# EAGLE design esp-12 (EAGLE 7.7.0)
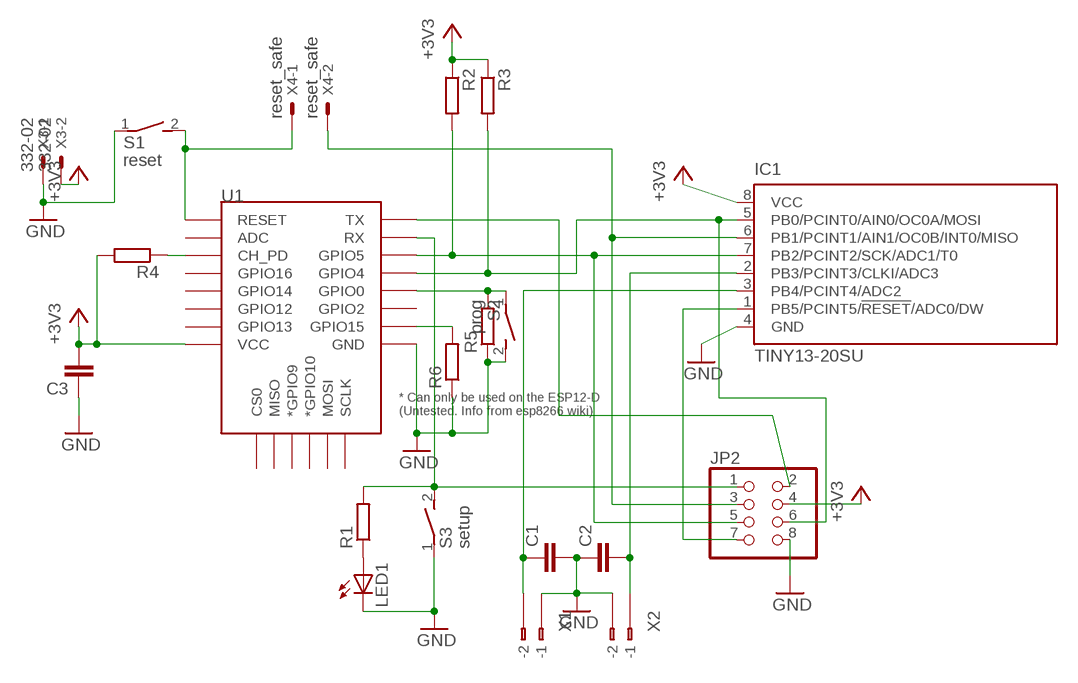
[diagram p0: schematic, sheet 1]

## Parts
C1  C-EUC0805  [C0805]
C2  C-EUC0805  [C0805]
C3  C-EUC0805  [C0805]
IC1  TINY13-20SU  [8S2]
JP2  PINHD-2X4  [2X04]
LED1  LEDSQR2X5  [LED2X5]
R1  R-EU_R0805  [R0805]
R2  R-EU_R0805  [R0805]
R3  R-EU_R0805  [R0805]
R4  R-EU_R0805  [R0805]
R5  R-EU_R0805  [R0805]
R6  R-EU_R0805  [R0805]
S1  reset  DS01E  [DS-01]
S2  prog  DS01E  [DS-01]
S3  setup  DS01E  [DS-01]
U1  ESP12ESMD  [ESP12E-SMD]
X1  233-102  [233-102]
X2  233-102  [233-102]
X3  332-02  [332-02]
X4  reset_safe  332-02  [332-02]

## Nets
+3V3: C3.2 IC1.8(VCC) JP2.4 R2.1 R3.1 R4.2 U1.VCC X3.2
GND: C1.2 C2.1 C3.1 IC1.4(GND) JP2.8 LED1.K(C) R5.1 R6.1 S1.1 S2.2 S3.1 U1.GND X1.B1(B-1) X2.B2(B-2) X3.1
N$1: IC1.7(PB2/PCINT2/SCK/ADC1/T0) JP2.5 R2.2 U1.GPIO5
N$2: IC1.5(PB0/PCINT0/AIN0/OC0A/MOSI) JP2.6 R3.2 U1.GPIO4
N$3: R5.2 S2.1 U1.GPIO0
N$4: R6.2 U1.GPIO15
N$5: IC1.1(PB5/PCINT5/!RESET!/ADC0/DW) JP2.7
N$6: C2.2 IC1.2(PB3/PCINT3/CLKI/ADC3) X2.B1(B-1)
N$7: IC1.6(PB1/PCINT1/AIN1/OC0B/INT0/MISO) JP2.3 X4.2
N$9: C1.1 IC1.3(PB4/PCINT4/ADC2) X1.B2(B-2)
N$10: S1.2 U1.RESET X4.1
N$11: LED1.A R1.1
N$12: JP2.2 U1.TXD0(TX)
N$13: JP2.1 R1.2 S3.2 U1.RXD0(RX)
N$84: R4.1 U1.CH_PD
Unconnected: U1.ADC U1.CS0 U1.GPIO2 U1.GPIO9(*GPIO9) U1.GPIO10(*GPIO10) U1.GPIO12 U1.GPIO13 U1.GPIO14 U1.GPIO16 U1.MISO U1.MOSI U1.SCLK X1.A1(-1) X1.A2(-2) X2.A1(-1) X2.A2(-2)

## Library data of the parts
C1-C3 = rcl:C-EU: CAPACITOR, European symbol
IC1 = atmel:TINY13: 8-bit AVR Microcontroller with 1K Bytes In-System Programmable Flash Source: http://www.atmel.com/dyn/resources/prod_documents/2535S.pdf; MPN: ATTINY13-20SU; OC_FARNELL: 9171568; OC_NEWARK: 96K6522
JP2 = pinhead:PINHD-2X4: PIN HEADER
LED1 = led:LED: LED OSRAM: - CHIPLED LG R971, LG N971, LY N971, LG Q971, LY Q971, LO R971, LY R971 LH N974, LH R974 LS Q976, LO Q976, LY Q976 LO Q996 - Hyper CHIPLED LW Q18S LB Q993, LB Q99A, LB R99A - SideLED LS A670, LO A670, LY A670, LG A670, LP A670 LB A673, LV A673, LT A673, LW A673 LH A674 LY A675 LS A676, LA A676, LO A676, LY A676, LW A676 LS A679, LY A679, LG A679 - Hyper Micro SIDELED® LS Y876, LA Y876, LO Y876, LY Y876 LT Y87S - SmartLED LW L88C, LW L88S LB L89C, LB L89S, LG L890 LS L89K, LO L89K, LY L89K LS L896, LA L896, LO L896, LY L896 - TOPLED LS T670, LO T670, LY T670, LG T670, LP T670 LSG T670, LSP T670, LSY T670, LOP T670, LYG T670 LG T671, LOG T671, LSG T671 LB T673, LV T673, LT T673, LW T673 LH T674 LS T676, LA T676, LO T676, LY T676, LB T676, LH T676, LSB T676, LW T676 LB T67C, LV T67C, LT T67C, LS T67K, LO T67K, LY T67K, LW E67C LS E67B, LA E67B, LO E67B, LY E67B, LB E67C, LV E67C, LT E67C LW T67C LS T679, LY T679, LG T679 LS T770, LO T770, LY T770, LG T770, LP T770 LB T773, LV T773, LT T773, LW T773 LH T774 LS E675, LA E675, LY E675, LS T675 LS T776, LA T776, LO T776, LY T776, LB T776 LHGB T686 LT T68C, LB T68C - Hyper Mini TOPLED® LB M676 - Mini TOPLED Santana® LG M470 LS M47K, LO M47K, LY M47K Source: http://www.osram.convergy.de LUXEON: - LUMILED® LXK2-PW12-R00, LXK2-PW12-S00, LXK2-PW14-U00, LXK2-PW14-V00 LXK2-PM12-R00, LXK2-PM12-S00, LXK2-PM14-U00 LXK2-PE12-Q00, LXK2-PE12-R00, LXK2-PE12-S00, LXK2-PE14-T00, LXK2-PE14-U00 LXK2-PB12-K00, LXK2-PB12-L00, LXK2-PB12-M00, LXK2-PB14-N00, LXK2-PB14-P00, LXK2-PB14-Q00 LXK2-PR12-L00, LXK2-PR12-M00, LXK2-PR14-Q00, LXK2-PR14-R00 LXK2-PD12-Q00, LXK2-PD12-R00, LXK2-PD12-S00 LXK2-PH12-R00, LXK2-PH12-S00 LXK2-PL12-P00, LXK2-PL12-Q00, LXK2-PL12-R00 Source: www.luxeon.com KINGBRIGHT: KA-3528ASYC Source: www.kingbright.com
R1-R6 = rcl:R-EU_: RESISTOR, European symbol
S1-S3 = switch-dil:DS01E: DIL/CODE SWITCH; OC_FARNELL: unknown; OC_NEWARK: unknown
U1 = esp8266modules:ESP12E: ESP12E Module
X1 X2 = con-wago:233-102: WAGO Cage Clamp; MPN: 233-102; OC_FARNELL: unknown; OC_NEWARK: 28K9044
X3 X4 = con-garry:332-02: 2 Pin - 2mm Dual Row Source: www.mpe-connector.de / garry_shortform_2012.pdf

## Board
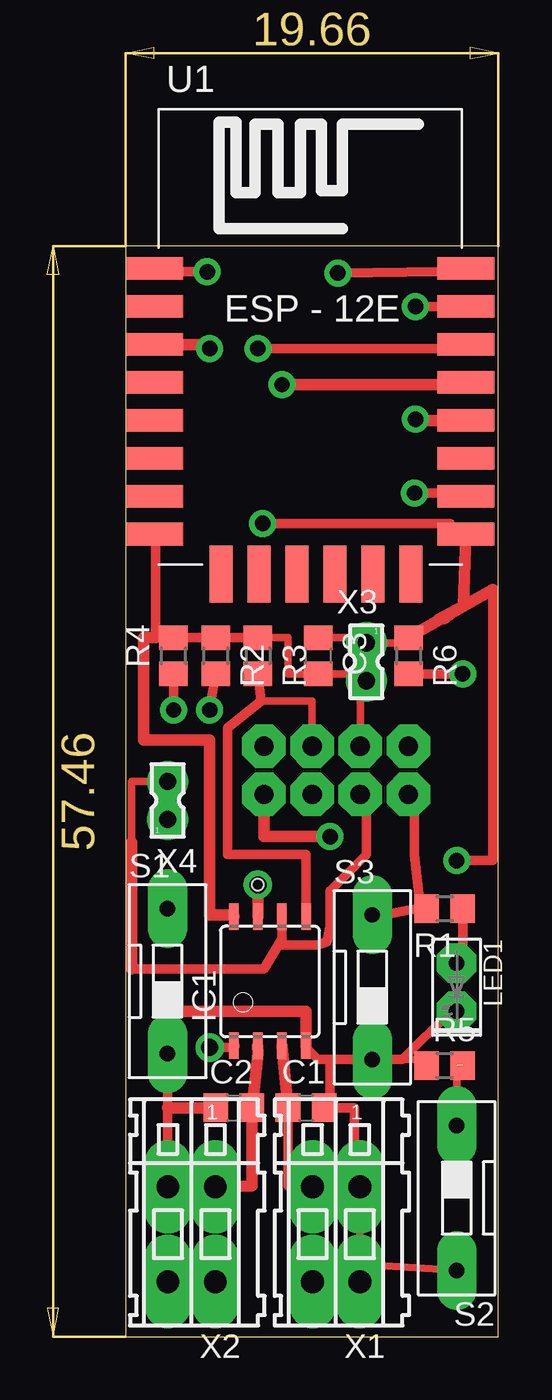
[diagram p1: board, top side]
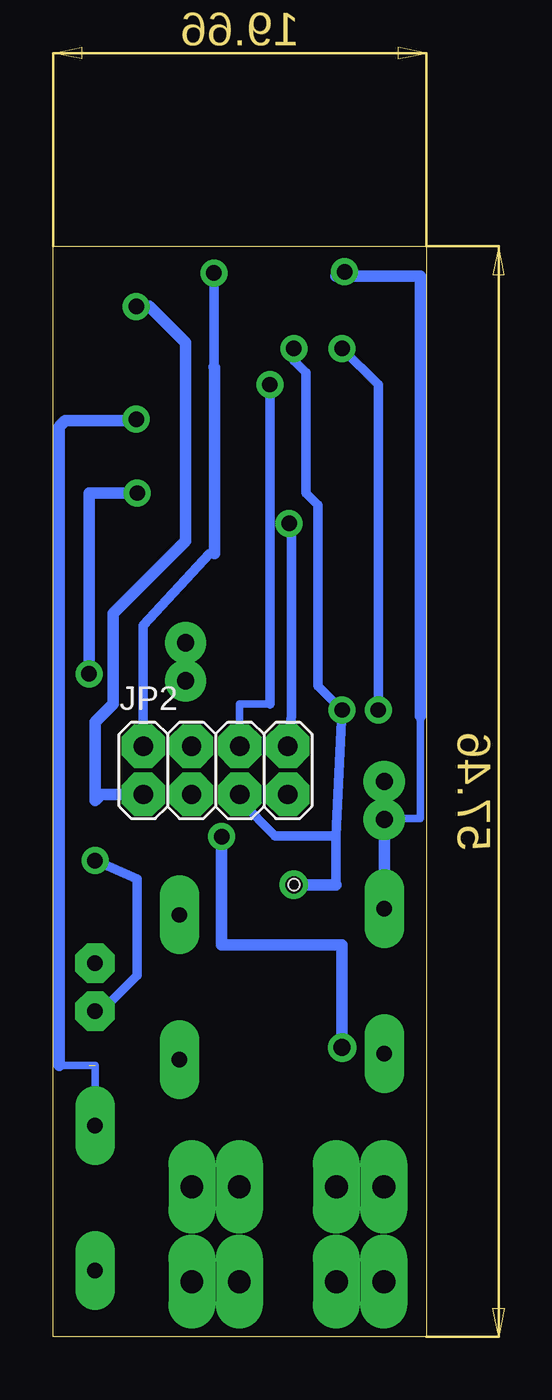
[diagram p2: board, bottom side, seen from below]

Size 19.66 x 57.46 mm. Coordinates in mm from the lower left corner, seen from the top.
Outline: 0,0 19.66,0 19.66,57.46 0,57.46 0,0
Copper layers (1*16): Top 0.035mm / dielectric 1.5mm / Bottom 0.035mm
Design rules "default *": minimum track width 20mil, minimum drill 32mil, track to track 16mil, track to pad 16mil, pad to pad 16mil, via to via 16mil, smd to smd 8mil, copper to edge 40mil, drill to drill 40mil, minimum pad ring 25mil, minimum via ring 12mil, stop-mask expansion 4mil, vias tented up to drill 0mil, thermal gap 10mil
Holes 0.6 mm at 6.99,23.81 6.99,23.81 6.99,23.81 6.99,23.81

### Footprints (pad centres in the part's own frame; a part is rotated, then mirrored left to right if it is on the bottom)
C0805 = smd 1.3 x 1.5: 1 -0.95,0; 2 0.95,0
8S2 = smd 0.5 x 1.4: 1 -1.905,-3.404; 2 -0.645,-3.404; 3 0.625,-3.404; 4 1.895,-3.404; 5 1.905,3.404; 6 0.635,3.404; 7 -0.635,3.404; 8 -1.905,3.404
2X04 = drill 1.016 octagon: 1 -3.81,-1.27; 2 -3.81,1.27; 3 -1.27,-1.27; 4 -1.27,1.27; 5 1.27,-1.27; 6 1.27,1.27; 7 3.81,-1.27; 8 3.81,1.27
LED2X5 = drill 0.813 octagon: A -1.27,0; K 1.27,0
R0805 = smd 1.3 x 1.5: 1 -0.95,0; 2 0.95,0
DS-01 = drill 0.813 long: 1 0,-3.81; 2 0,3.81
ESP12E-SMD = smd 3 x 1.2: ADC -8.3,3.8; CH_PD -8.3,1.8; GND 8.1,-8.2; GPIO0 8.1,-2.2; GPIO2 8.1,-4.2; GPIO4 8.1,-0.2; GPIO5 8.1,1.8; GPIO12 -8.3,-4.2; GPIO13 -8.3,-6.2; GPIO14 -8.3,-2.2; GPIO15 8.1,-6.2; GPIO16 -8.3,-0.2; RESET -8.3,5.8; RXD0 8.1,3.8; TXD0 8.1,5.8; VCC -8.3,-8.2 | smd 1.2 x 3: CS0 -4.8,-10.3; GPIO9 -0.8,-10.3; GPIO10 1.2,-10.3; MISO -2.8,-10.3; MOSI 3.2,-10.3; SCLK 5.2,-10.3
233-102 = drill 1.2 long: A1 -1.25,2.5; A2 1.25,2.5; B1 -1.25,-2.5; B2 1.25,-2.5
332-02 = drill 0.9 pad 1.27: 1 0,-1; 2 0,1

### Placement (x,y rotation side)
C1  9.52,12.07 0 top
C2  5.72,12.07 0 top
C3  10.16,35.88 270 top
IC1  7.62,18.73 0 top
JP2  11.11,29.84 0 bottom
LED1  17.46,18.41 270 top
R1  16.83,22.54 180 top
R2  4.76,35.88 270 top
R3  6.99,35.88 270 top
R4  2.54,35.88 90 top
R5  16.83,14.29 0 top
R6  14.92,35.88 270 top
S1  2.22,18.73 0 top
S2  17.46,7.3 180 top
S3  13.02,18.41 0 top
U1  9.84,50.48 0 top
X1  11.11,5.4 180 top
X2  3.49,5.4 180 top
X3  12.7,35.56 180 top
X4  2.22,28.26 0 top

### Tracks (layer width: path | path; a pad name or v marks a point on that pad's centre or on a via)
+3V3
  Top 0.406: JP2.4 12.38,34.56 X3.2 12.7,34.93 C3.2 8.57,34.93 8.57,36.83 7.62,36.83
  Top 0.508: 5.08,36.83 R4.2 | 5.08,36.83 7.62,36.83 R3.1 | 5.08,36.83 R2.1 | R4.2 1.59,36.83 1.59,42.23 U1.VCC | R4.2
  Top 0.61: IC1.8 5.63,22.23 4.45,22.23 4.45,31.43 0.95,31.43 0.95,36.83 1.59,36.83
GND  (via drill 0.81)
  Top 0.406: C3.1 12.7,36.83 X3.1 14.92,36.56 R6.1 | 14.61,14.61 15.88,14.61 R5.1 | S2.2 12.36,3.81 X1.B1
  Top 0.508: S3.1 10.8,14.61 | 10.8,14.61 10.16,14.61 9.52,15.24 IC1.4 | 10.8,14.61 10.8,12.07 | 2.22,14.29 2.22,12.07 2.22,7.94 X2.B2 | 10.8,12.07 12.07,12.07 12.07,7.94 X1.B1 | 10.8,12.07 C1.2 | 13.46,14.96 S3.1 | v7.24,42.85 17.12,42.85 17.58,42.39 U1.GND | S3.1 14.61,14.61 17.14,17.15 LED1.K | v17.46,25.08 19.37,25.08 19.37,39.37 | 16.77,37.88 16.83,37.78 17.81,38.51
  Top 0.61: 2.22,14.29 S1.1 2.22,17.15 9.52,17.15 IC1.4 | U1.GND 17.81,38.51 16.51,37.78 | 19.37,39.37 16.77,37.88 R6.1 | 5.08,12.07 C2.1 2.22,12.07
  Bottom 0.508: v7.24,42.85 7.1,42.71 7.1,32.73 JP2.8 | v17.46,25.08 15.24,24.13 15.24,19.05 17.14,17.15 LED1.K
N$1  (via drill 0.81, 0.9 pad 1.02)
  Top 0.508: v4.45,33.02 R2.2 | v6.99,52.07 17.78,52.07 U1.GPIO5
  Top 0.61: IC1.7 v6.99,23.81
  Bottom 0.508: 4.76,26.39 v4.45,33.02 5.72,34.29 5.72,43.81 6.35,44.45 6.35,50.8 6.99,51.43 v6.99,52.07 | 4.76,26.39 4.76,23.81 | 4.76,26.39 7.98,26.39 9.8,28.22 JP2.5
  Bottom 0.61: 4.76,23.81 v6.99,23.81
N$2  (via drill 0.81)
  Top 0.406: 7.14,33.5 9.84,33.5 JP2.6
  Top 0.508: IC1.5 9.52,25.4 5.4,25.4 5.4,32.07 7.14,33.5 R3.2
  Top 0.61: U1.GPIO4 17.82,50.16 v8.25,50.16
  Bottom 0.406: 8.25,33.34 9.84,33.34 JP2.6
  Bottom 0.508: 8.25,33.34 v8.25,50.16
N$3  (via drill 0.81)  (1 unrouted)
  Top 0.406: R5.2 17.46,14.29 S2.1
  Top 0.508: v15.29,48.34 15.29,48.26
  Top 0.61: U1.GPIO0 17.92,48.26 | 17.92,48.26 15.29,48.26 14.92,48.26 | 17.92,48.26 19.05,48.26
  Bottom 0.406: 19.37,14.29 17.46,14.29 S2.1
  Bottom 0.508: v15.29,48.34 15.29,48.26
  Bottom 0.61: 19.37,14.29 19.37,47.94 19.05,48.26 15.29,48.26 14.92,48.26
N$4  (via drill 0.81)
  Top 0.508: v15.24,44.45 17.78,44.45 U1.GPIO15 | v17.78,34.93 R6.2
  Bottom 0.61: v15.24,44.45 17.78,44.45 v17.78,34.93
N$5  (via drill 0.81, 0.9 pad 1.02)
  Top 0.508: v4.45,15.24 5.72,15.24 IC1.1
  Top 0.61: IC1.1 arc-90 5.63,15.24 | 4.13,15.24 v4.45,15.24 4.45,15.33 | JP2.7 7.3,26.35 v10.8,26.35
  Bottom 0.61: v4.45,15.24 4.45,20.64 10.8,20.64 v10.8,26.35
N$6
  Top 0.61: IC1.2 6.99,14.92 C2.2 6.67,7.94 X2.B1
N$7
  Top 0.406: X4.2 0.32,29.26 0.32,26.04
  Top 0.508: 8.25,20.95 8.25,20.64 10.16,20.64 10.64,20.8 10.8,21.59 10.8,23.49 12.7,25.4 12.7,28.58 JP2.3 | 8.25,20.95 IC1.6 | 0.32,19.37 7.3,19.37 8.25,20.95
  Top 0.61: 0.32,26.04 0.32,19.37
N$9
  Top 0.508: C1.1 8.57,7.94 9.84,7.94 X1.B2
  Top 0.61: IC1.3 C1.1
N$10  (via drill 0.81)
  Top 0.508: v4.32,56.11 1.58,56.11 U1.RESET
  Bottom 0.406: 0.32,32.7 0.32,27.3 2.22,27.3
  Bottom 0.508: v4.32,56.11 4.32,55.88
  Bottom 0.61: 0.32,32.7 0.32,55.88 4.32,55.88 4.76,55.88 | 2.22,27.3 X4.1 S1.2 2.22,22.23
N$11
  Top 0.508: R1.1 17.78,22.23 17.78,19.69 LED1.A
N$12  (via drill 0.81)
  Top 0.508: v11.2,56.04 16.66,56.11 17.58,56.11 U1.TXD0
  Bottom 0.508: 11.2,51.08 v11.2,56.04 | JP2.2 14.92,37.47 11.43,41.27 11.18,41.27
  Bottom 0.61: 11.2,51.08 11.18,51.05 11.18,41.27
N$13  (via drill 0.81)
  Top 0.508: 15.55,22.6 13.32,22.16 13,22.28 S3.2 | 15.55,22.6 R1.2 | v15.29,54.28 17.58,54.28 U1.RXD0 | JP2.1 15.24,28.58 15.24,25.4 15.55,22.6
  Bottom 0.508: 13.02,21.91 S3.2 | v15.29,54.28 15.29,54.29
  Bottom 0.61: 15.56,54.29 15.29,54.29 14.61,54.29 12.7,52.39 12.7,41.91 16.51,38.1 16.51,33.34 17.46,32.38 17.46,28.26 17.14,28.58 JP2.1
N$84  (via drill 0.81)
  Top 0.508: v2.54,33.02 R4.1 | v4.45,52.07 4.23,52.28
  Top 0.61: U1.CH_PD 4.23,52.28 arc-90 v4.45,52.07
  Bottom 0.508: v2.54,33.02 2.54,50.16 v4.45,52.07